# Altium schematic sheet A3000_16MB_Glue.SchDoc
size A3; DocumentNumber: 1; SheetNumber: 1; SheetTotal: 5
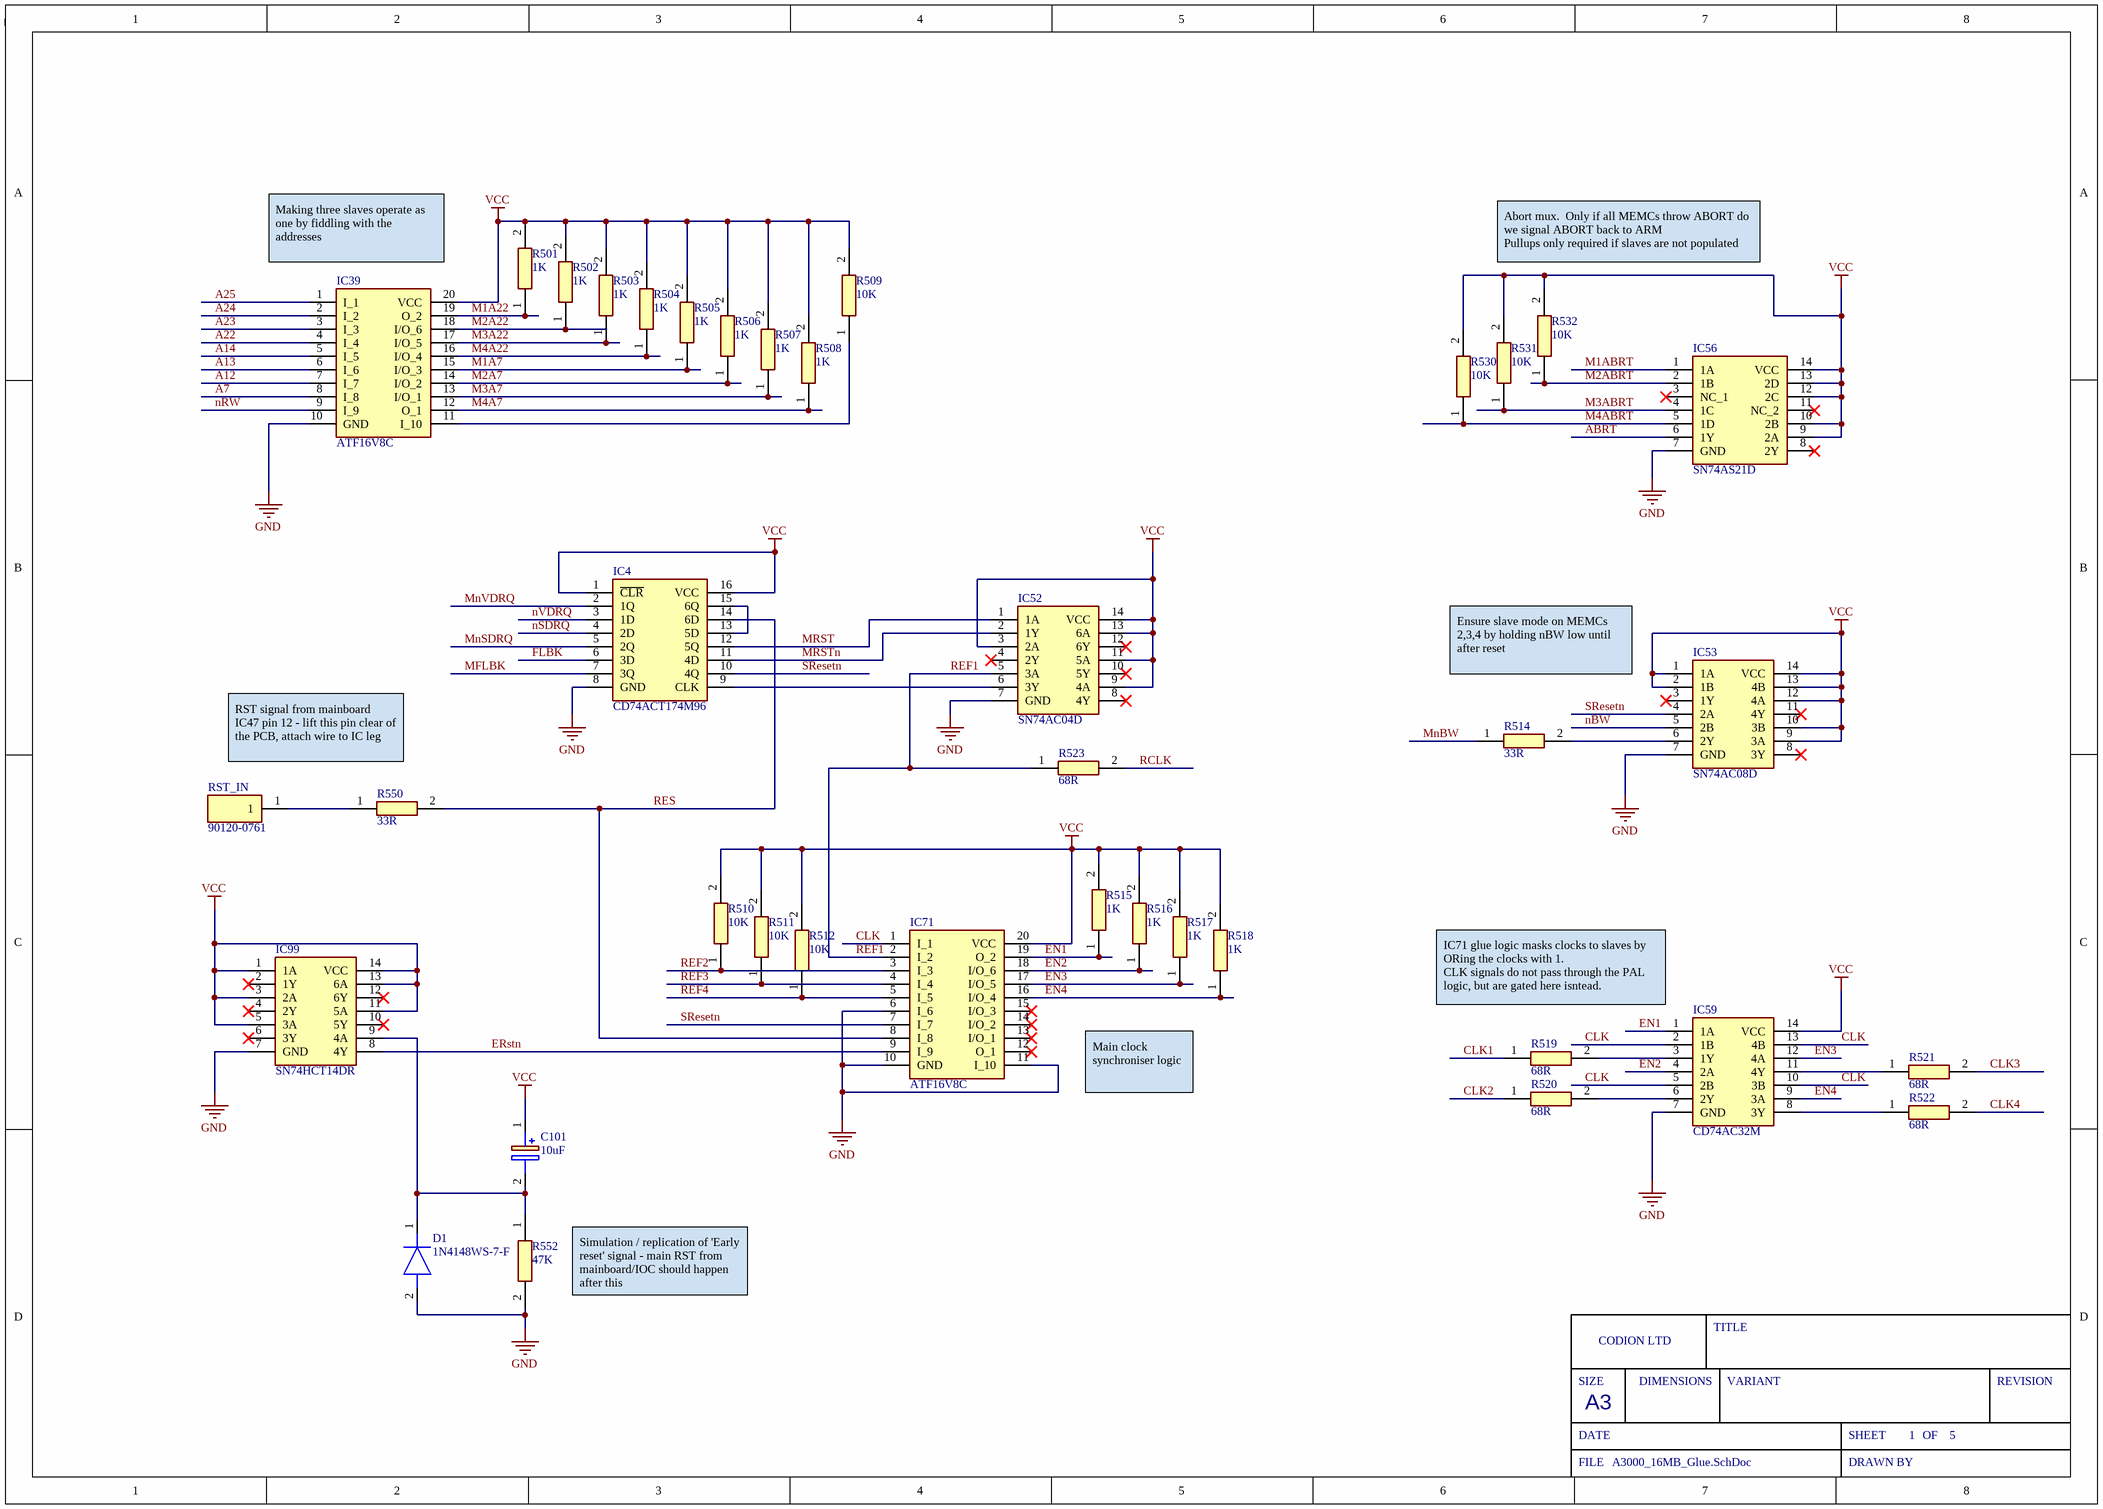
[diagram p0: A3000_16MB_Glue.SchDoc]

## Parts
C101  10uF  [EEE0GA101SR]
D1  1N4148WS-7-F  [SOD2513X120N]
IC4  CD74ACT174M96  [SOIC127P600X175-16N]
IC39  ATF16V8C  [DIP762W66P254L2692H508Q20N]
IC52  SN74AC04D  [SOIC127P600X175-14N]
IC53  SN74AC08D  [SOIC127P600X175-14N]
IC56  SN74AS21D  [SOIC127P600X175-14N]
IC59  CD74AC32M  [SOIC127P600X175-14N]
IC71  ATF16V8C  [DIP762W66P254L2692H508Q20N]
IC99  SN74HCT14DR  [SOIC127P600X175-14N]
R501  1K  [RESC1005X40N]
R502  1K  [RESC1005X40N]
R503  1K  [RESC1005X40N]
R504  1K  [RESC1005X40N]
R505  1K  [RESC1005X40N]
R506  1K  [RESC1005X40N]
R507  1K  [RESC1005X40N]
R508  1K  [RESC1005X40N]
R509  10K  [RESC1005X40N]
R510  10K  [RESC1005X40N]
R511  10K  [RESC1005X40N]
R512  10K  [RESC1005X40N]
R514  33R  [RESC1005X40N]
R515  1K  [RESC1005X40N]
R516  1K  [RESC1005X40N]
R517  1K  [RESC1005X40N]
R518  1K  [RESC1005X40N]
R519  68R  [RESC1005X40N]
R520  68R  [RESC1005X40N]
R521  68R  [RESC1005X40N]
R522  68R  [RESC1005X40N]
R523  68R  [RESC1005X40N]
R530  10K  [RESC1005X40N]
R531  10K  [RESC1005X40N]
R532  10K  [RESC1005X40N]
R550  33R  [RESC1005X40N]
R552  47K  [RESC1005X40N]
RST_IN  90120-0761  [HDRV1W90P0X254_1X1_232X249X560P]

## Nets
GND: D1.2(A) IC4.8(GND) IC39.10(GND) IC52.7(GND) IC53.7(GND) IC56.7(GND) IC59.7(GND) IC71.6(I_6) IC71.10(GND) IC71.11(I_10) IC99.7(GND) R552.2
VCC: C101.1(+) IC4.1(~{CLR}) IC4.16(VCC) IC39.20(VCC) IC52.3(2A) IC52.9(4A) IC52.11(5A) IC52.13(6A) IC52.14(VCC) IC53.1(1A) IC53.2(1B) IC53.9(3A) IC53.10(3B) IC53.12(4A) IC53.13(4B) IC53.14(VCC) IC56.9(2A) IC56.10(2B) IC56.12(2C) IC56.13(2D) IC56.14(VCC) IC59.14(VCC) IC71.20(VCC) IC99.1(1A) IC99.3(2A) IC99.5(3A) IC99.11(5A) IC99.13(6A) IC99.14(VCC) R501.2 R502.2 R503.2 R504.2 R505.2 R506.2 R507.2 R508.2 R509.2 R510.2 R511.2 R512.2 R515.2 R516.2 R517.2 R518.2 R530.2 R531.2 R532.2
A7: IC39.8(I_8)
A12: IC39.7(I_7)
A13: IC39.6(I_6)
A14: IC39.5(I_5)
A22: IC39.4(I_4)
A23: IC39.3(I_3)
A24: IC39.2(I_2)
A25: IC39.1(I_1)
ABRT: IC56.6(1Y)
CLK: IC59.2(1B) IC59.5(2B) IC59.10(3B) IC59.13(4B) IC71.1(I_1)
CLK1: R519.1
CLK2: R520.1
CLK3: R521.2
CLK4: R522.2
EN1: IC59.1(1A) IC71.19(O_2) R515.1
EN2: IC59.4(2A) IC71.18(I/O_6) R516.1
EN3: IC59.12(4A) IC71.17(I/O_5) R517.1
EN4: IC59.9(3A) IC71.16(I/O_4) R518.1
ERstn: IC71.9(I_9) IC99.8(4Y)
FLBK: IC4.6(3D)
M1A7: IC39.15(I/O_3) R505.1
M1A22: IC39.19(O_2) R501.1
M1ABRT: IC56.1(1A)
M2A7: IC39.14(I/O_2) R506.1
M2A22: IC39.18(I/O_6) R502.1
M2ABRT: IC56.2(1B) R532.1
M3A7: IC39.13(I/O_1) R507.1
M3A22: IC39.17(I/O_5) R503.1
M3ABRT: IC56.4(1C) R531.1
M4A7: IC39.12(O_1) R508.1
M4A22: IC39.16(I/O_4) R504.1
M4ABRT: IC56.5(1D) R530.1
MFLBK: IC4.7(3Q)
MnBW: R514.1
MnSDRQ: IC4.5(2Q)
MnVDRQ: IC4.2(1Q)
MRST: IC4.12(5Q) IC52.1(1A)
MRSTn: IC4.11(4D) IC52.2(1Y)
nBW: IC53.5(2B)
nRW: IC39.9(I_9)
nSDRQ: IC4.4(2D)
nVDRQ: IC4.3(1D)
RCLK: R523.2
REF1: IC52.5(3A) IC71.2(I_2) R523.1
REF2: IC71.3(I_3) R510.1
REF3: IC71.4(I_4) R511.1
REF4: IC71.5(I_5) R512.1
RES: IC4.14(6D) IC71.8(I_8) R550.2
SResetn: IC4.10(4Q) IC53.4(2A) IC71.7(I_7)
NetC101_2: C101.2(-) D1.1(K) IC99.9(4A) R552.1
NetIC4_9: IC4.9(CLK) IC52.6(3Y)
NetIC4_13: IC4.13(5D) IC4.15(6Q)
NetIC39_11: IC39.11(I_10) R509.1
NetIC53_6: IC53.6(2Y) R514.2
NetIC59_3: IC59.3(1Y) R519.2
NetIC59_6: IC59.6(2Y) R520.2
NetIC59_8: IC59.8(3Y) R522.1
NetIC59_11: IC59.11(4Y) R521.1
NetR550_1: R550.1 RST_IN.1

Not connected (* = marked no-connect by the designer): IC52 4(2Y)* 8(4Y)* 10(5Y)* 12(6Y)*; IC53 3(1Y)* 8(3Y)* 11(4Y)*; IC56 3(NC_1)* 8(2Y)* 11(NC_2)*; IC71 12(O_1)* 13(I/O_1)* 14(I/O_2)* 15(I/O_3)*; IC99 2(1Y)* 4(2Y)* 6(3Y)* 10(5Y)* 12(6Y)*

## Notes on the sheet
- (near IC39) Making three slaves operate as one by fiddling with the addresses
- Abort mux.  Only if all MEMCs throw ABORT do we signal ABORT back to ARM
  Pullups only required if slaves are not populated
- Ensure slave mode on MEMCs 2,3,4 by holding nBW low until after reset
- RST signal from mainboard IC47 pin 12 - lift this pin clear of the PCB, attach wire to IC leg
- IC71 glue logic masks clocks to slaves by ORing the clocks with 1.
  CLK signals do not pass through the PAL logic, but are gated here isntead.
- Main clock synchroniser logic
- Simulation / replication of 'Early reset' signal - main RST from mainboard/IOC should happen after this
- SIZE
- CODION LTD
- DIMENSIONS
- TITLE
- VARIANT
- REVISION
- DATE
- A3
- SHEET
- OF
- FILE
- DRAWN BY

## Library data of the parts
C101 = EEE-1EA100SR: Capacitor Polarised; Manufacturer_Name: Panasonic; Datasheet Link: http://industrial.panasonic.com/cdbs/www-data/pdf/RDE0000/ABA0000C1145.pdf; Height: 6.5mm; Manufacturer_Part_Number: EEE-1EA100SR; Mouser Part Number: 667-EEE-1EA100SR; Mouser Price/Stock: https://www.mouser.co.uk/ProductDetail/Panasonic/EEE-1EA100SR?qs=ANJC8C65Mw4%2Fvo1GoepKcQ%3D%3D; Arrow Part Number: EEE-1EA100SR; Arrow Price/Stock: https://www.arrow.com/en/products/eee-1ea100sr/panasonic?region=nac
D1 = 1N4148WS-7-F: Diode; Manufacturer_Name: Diodes Inc.; Datasheet Link: https://componentsearchengine.com/Datasheets/2/1N4148WS-7-F.pdf; Height: 1.2mm; Manufacturer_Part_Number: 1N4148WS-7-F; Mouser Part Number: 621-1N4148WS-F; Mouser Price/Stock: https://www.mouser.co.uk/ProductDetail/Diodes-Incorporated/1N4148WS-7-F?qs=4drIV0IxA0r8aNy7%2Fu4kVw%3D%3D; Arrow Part Number: 1N4148WS-7-F; Arrow Price/Stock: https://www.arrow.com/en/products/1n4148ws-7-f/diodes-incorporated?region=asia; LCSC Part #: C2128
IC4 = CD74ACT174M96: Integrated Circuit; Manufacturer_Name: Texas Instruments; Datasheet Link: http://www.ti.com/lit/gpn/cd74act174; Height: 1.75mm; Manufacturer_Part_Number: CD74ACT174M96; Mouser Part Number: 595-CD74ACT174M96; Mouser Price/Stock: https://www.mouser.co.uk/ProductDetail/Texas-Instruments/CD74ACT174M96?qs=w32V8uFkMxkDXs1ka6HDkg%3D%3D
IC39 IC71 = PAL16R4AMJ: Integrated Circuit; Manufacturer_Name: Texas Instruments; Datasheet Link: http://www.ti.com/lit/ds/symlink/pal16r4am.pdf; Height: 5.08mm; Manufacturer_Part_Number: PAL16R4AMJ; Mouser Part Number: 595-PAL16R4AMJ; Mouser Price/Stock: https://www.mouser.com/Search/Refine.aspx?Keyword=595-PAL16R4AMJ
IC52 = SN74AC04D: Integrated Circuit; Manufacturer_Name: Texas Instruments; Datasheet Link: http://www.ti.com/lit/ds/symlink/sn74ac04.pdf; Height: 1.75mm; Manufacturer_Part_Number: SN74AC04D; Mouser Part Number: 595-SN74AC04D; Mouser Price/Stock: https://www.mouser.co.uk/ProductDetail/Texas-Instruments/SN74AC04D?qs=w32V8uFkMxkvsyMHHacuZw%3D%3D; Arrow Part Number: SN74AC04D; Arrow Price/Stock: https://www.arrow.com/en/products/sn74ac04d/texas-instruments?region=nac; LCSC Part #: C352940
IC53 = SN74AC08D: Integrated Circuit; Manufacturer_Name: Texas Instruments; Datasheet Link: http://www.ti.com/lit/gpn/sn74ac08; Height: 1.75mm; Manufacturer_Part_Number: SN74AC08D; Mouser Part Number: 595-SN74AC08D; Mouser Price/Stock: https://www.mouser.co.uk/ProductDetail/Texas-Instruments/SN74AC08D?qs=w32V8uFkMxlOh0tslhqkwg%3D%3D; Arrow Part Number: SN74AC08D; Arrow Price/Stock: https://www.arrow.com/en/products/sn74ac08d/texas-instruments; LCSC Part #: C352941
IC56 = SN74AS21D: Integrated Circuit; Manufacturer_Name: Texas Instruments; Datasheet Link: https://www.ti.com/lit/ds/symlink/sn74as21.pdf?HQS=dis-mous-null-mousermode-dsf-pf-null-wwe&ts=1632126162167&ref_url=https%253A%252F%252Fwww.mouser.in%252F; Height: 1.75mm; Manufacturer_Part_Number: SN74AS21D; Mouser Part Number: 595-SN74AS21D; Mouser Price/Stock: https://www.mouser.com/Search/Refine.aspx?Keyword=595-SN74AS21D; Arrow Part Number: SN74AS21D; Arrow Price/Stock: https://www.arrow.com/en/products/sn74as21d/texas-instruments
IC59 = CD74AC32M: Integrated Circuit; Manufacturer_Name: Texas Instruments; Datasheet Link: http://www.ti.com/lit/ds/symlink/cd74ac32.pdf; Height: 1.75mm; Manufacturer_Part_Number: CD74AC32M; Mouser Part Number: 595-CD74AC32M; Mouser Price/Stock: https://www.mouser.co.uk/ProductDetail/Texas-Instruments/CD74AC32M?qs=OorDGPQ79Eqsy7tzrsTtUg%3D%3D; Arrow Part Number: CD74AC32M; Arrow Price/Stock: https://www.arrow.com/en/products/cd74ac32m/texas-instruments; LCSC Part #: C352943
IC99 = SN74HCT14DR: Integrated Circuit; Manufacturer_Name: Texas Instruments; Datasheet Link: http://www.ti.com/lit/ds/symlink/sn74hct14.pdf; Height: 1.75mm; Manufacturer_Part_Number: SN74HCT14DR; Mouser Part Number: 595-SN74HCT14DR; Mouser Price/Stock: https://www.mouser.co.uk/ProductDetail/Texas-Instruments/SN74HCT14DR?qs=SL3LIuy2dWxogEVGE105Iw%3D%3D; Arrow Part Number: SN74HCT14DR; Arrow Price/Stock: https://www.arrow.com/en/products/sn74hct14dr/texas-instruments?region=nac; LCSC Part #: C6769
R501-R508 R515-R518 = CRCW04021K00JNED: Resistor; Manufacturer_Name: Vishay; Datasheet Link: http://www.vishay.com/docs/20035/dcrcwe3.pdf; Height: 0.4mm; Manufacturer_Part_Number: CRCW04021K00JNED; Mouser Part Number: 71-CRCW0402J-1.0K-E3; Mouser Price/Stock: https://www.mouser.co.uk/ProductDetail/Vishay-Dale/CRCW04021K00JNED?qs=YX%252BK5oaHNYpGRsHVuzxl1A%3D%3D; Arrow Part Number: CRCW04021K00JNED; Arrow Price/Stock: https://www.arrow.com/en/products/crcw04021k00jned/vishay; LCSC Part #: C279981
R509-R512 R530-R532 = CRCW040210K0FKEDHP: Resistor; Manufacturer_Name: Vishay; Datasheet Link: http://www.vishay.com/docs/20035/dcrcwe3.pdf; Height: 0.4mm; Manufacturer_Part_Number: CRCW040210K0FKEDHP; Mouser Part Number: 71-CRCW040210K0FKEDH; Mouser Price/Stock: https://www.mouser.co.uk/ProductDetail/Vishay-Dale/CRCW040210K0FKEDHP?qs=FlFvgi4rxBxmIiaeyFjrkA%3D%3D; Arrow Part Number: CRCW040210K0FKEDHP; Arrow Price/Stock: https://www.arrow.com/en/products/crcw040210k0fkedhp/vishay?region=nac; LCSC Part #: C71617
R514 R550 = CRCW040233R0FKED: Resistor; Manufacturer_Name: Vishay; Datasheet Link: http://www.vishay.com/docs/20035/dcrcwe3.pdf; Height: 0.4mm; Manufacturer_Part_Number: CRCW040233R0FKED; Mouser Part Number: 71-CRCW0402-33-E3; Mouser Price/Stock: https://www.mouser.co.uk/ProductDetail/Vishay-Dale/CRCW040233R0FKED?qs=TNtMkGKFKOyo77UGFlXIJw%3D%3D; Arrow Part Number: CRCW040233R0FKED; Arrow Price/Stock: https://www.arrow.com/en/products/crcw040233r0fked/vishay; LCSC Part #: C137880
R519-R523 = CRCW040268R0FKEDHP: Resistor; Manufacturer_Name: Vishay; Datasheet Link: http://www.vishay.com/docs/20035/dcrcwe3.pdf; Height: 0.4mm; Manufacturer_Part_Number: CRCW040268R0FKEDHP; Mouser Part Number: 71-CRCW040268R0FKEDH; Mouser Price/Stock: https://www.mouser.co.uk/ProductDetail/Vishay-Dale/CRCW040268R0FKEDHP?qs=YaA%252B3EhhSt26vU44iyW%252BOw%3D%3D; Arrow Part Number: CRCW040268R0FKEDHP; Arrow Price/Stock: https://www.arrow.com/en/products/crcw040268r0fkedhp/vishay; LCSC Part #: C163455
R552 = CRCW040247K0FKED: Resistor; Manufacturer_Name: Vishay; Datasheet Link: http://www.vishay.com/docs/20035/dcrcwe3.pdf; Height: 0.4mm; Manufacturer_Part_Number: CRCW040247K0FKED; Mouser Part Number: 71-CRCW0402-47K-E3; Mouser Price/Stock: https://www.mouser.co.uk/ProductDetail/Vishay-Dale/CRCW040247K0FKED?qs=rzhQWu8UUS0SPbmGf0DOIg%3D%3D; Arrow Part Number: CRCW040247K0FKED; Arrow Price/Stock: https://www.arrow.com/en/products/crcw040247k0fked/vishay; LCSC Part #: C163440
RST_IN = 90120-0761: Connector; Manufacturer_Name: Molex; Datasheet Link: https://www.molex.com/pdm_docs/sd/901200761_sd.pdf; Height: 5.6mm; Manufacturer_Part_Number: 90120-0761; Mouser Part Number: 538-90120-0761; Mouser Price/Stock: https://www.mouser.co.uk/ProductDetail/Molex/90120-0761?qs=PvP5v7Eimsn%2F58TpDaAAow%3D%3D